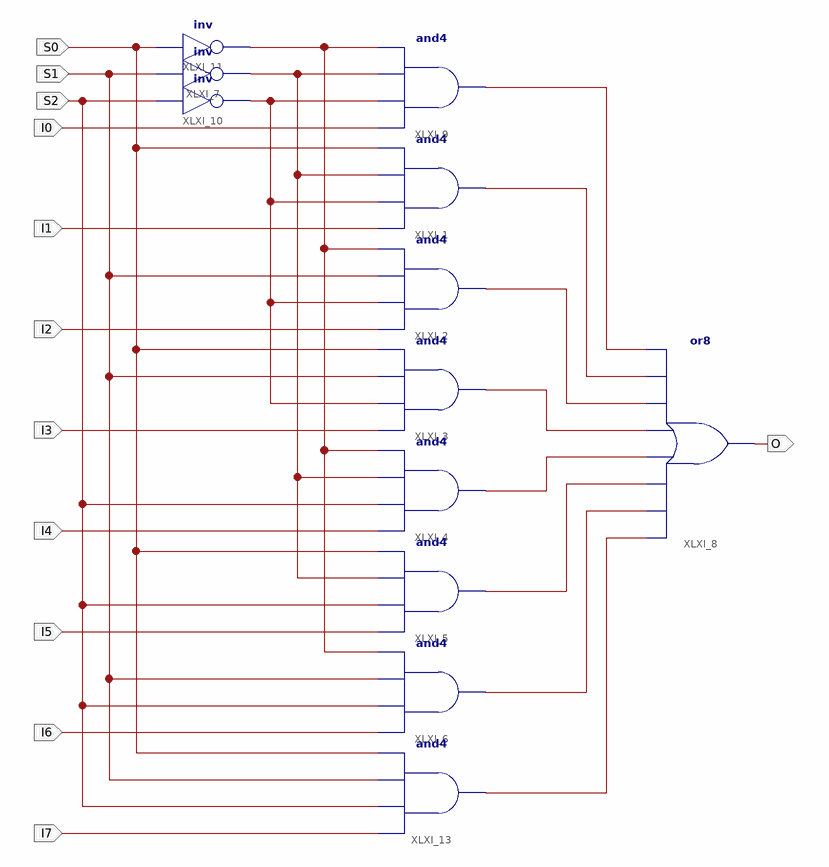
[diagram p0: schematic sheet 1]
// Xilinx ISE schematic MUX8_1.sch (virtex6) as structural Verilog: 12 symbols, 12 ports
module MUX8_1 (
  input  S0,
  input  S2,
  input  I0,
  input  I1,
  input  I2,
  input  I3,
  input  I4,
  input  I5,
  input  I6,
  input  I7,
  input  S1,
  output O
);

  wire XLXN_1, XLXN_2, XLXN_3, XLXN_4, XLXN_5, XLXN_7, XLXN_9, XLXN_11, XLXN_32, XLXN_52, XLXN_57;

  and XLXI_1 (XLXN_2, I1, XLXN_57, XLXN_52, S0);
  and XLXI_2 (XLXN_3, I2, XLXN_57, S1, XLXN_32);
  and XLXI_3 (XLXN_4, I3, XLXN_57, S1, S0);
  and XLXI_4 (XLXN_5, I4, S2, XLXN_52, XLXN_32);
  and XLXI_5 (XLXN_7, I5, S2, XLXN_52, S0);
  and XLXI_6 (XLXN_9, I6, S2, S1, XLXN_32);
  and XLXI_13 (XLXN_11, I7, S2, S1, S0);
  or XLXI_8 (O, XLXN_11, XLXN_9, XLXN_7, XLXN_5, XLXN_4, XLXN_3, XLXN_2, XLXN_1);
  and XLXI_9 (XLXN_1, I0, XLXN_57, XLXN_52, XLXN_32);
  not XLXI_10 (XLXN_57, S2);
  not XLXI_11 (XLXN_32, S0);
  not XLXI_7 (XLXN_52, S1);
endmodule
